# EasyEDA Pro project sonnette.epro, schematic Schematic1
Board Name: Board1; Create Date: 2026-03-04; Page Name: P1; Project Name: rk3506_doorbell; Schematic Name: Schematic1; Update Date: 2026-05-03; Company: Sonnette - Smart SIP Doorbell; Drawn: Pierre Jay; Page Size: A0; Version: V1.0
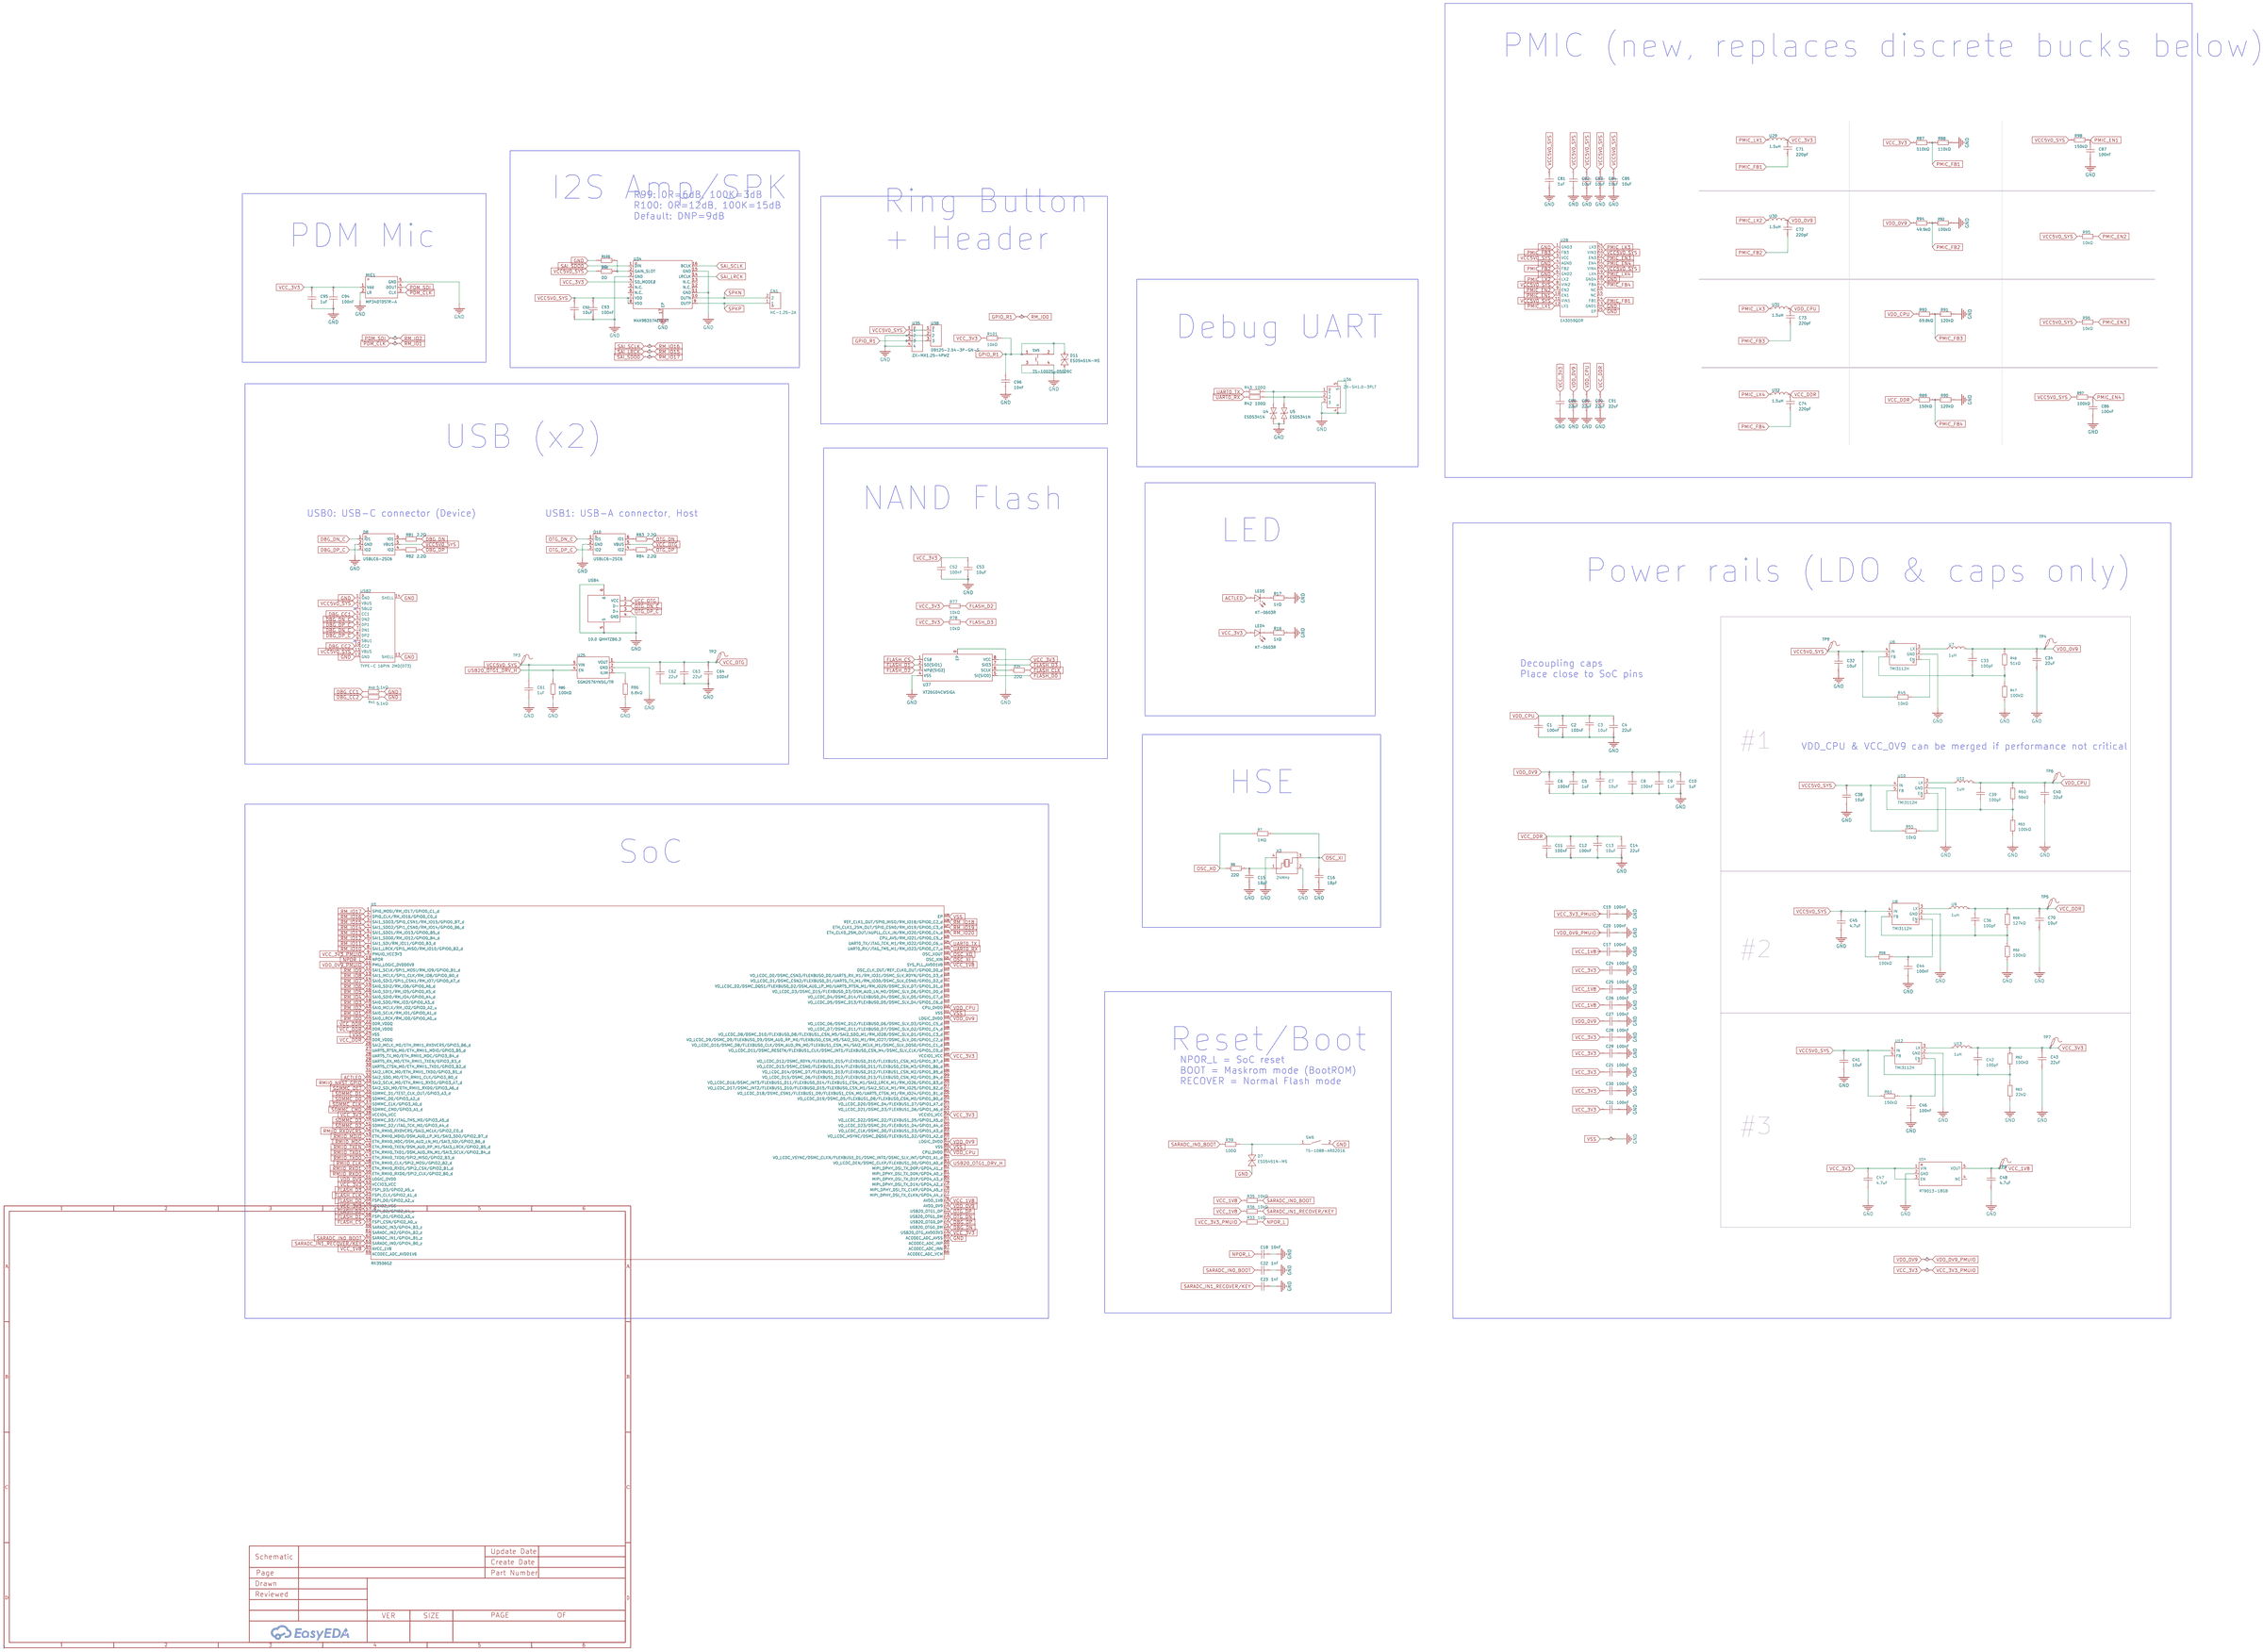
[diagram p0: schematic sheet]

## Parts
C1  100nF  [C0402]
C2  100nF  [C0402]
C3  10uF  [C0402]
C4  22uF  [C0603]
C5  1uF  [C0402]
C6  100nF  [C0402]
C7  10uF  [C0402]
C8  100nF  [C0402]
C9  1uF  [C0402]
C10  1uF  [C0402]
C11  100nF  [C0402]
C12  100nF  [C0402]
C13  10uF  [C0402]
C14  22uF  [C0603]
C15  18pF  [C0402]
C16  18pF  [C0402]
C17  100nF  [C0402]
C18  10nF  [C0402]
C19  100nF  [C0402]
C20  100nF  [C0402]
C21  100nF  [C0402]
C22  1nF  [C0402]
C23  1nF  [C0402]
C24  100nF  [C0402]
C25  100nF  [C0402]
C26  100nF  [C0402]
C27  100nF  [C0402]
C28  100nF  [C0402]
C29  100nF  [C0402]
C30  100nF  [C0402]
C31  100nF  [C0402]
C32  10uF  [C0603]  (no BOM)
C33  100pF  [C0402]  (no BOM)
C34  22uF  [C0603]  (no BOM)
C36  100pF  [C0402]  (no BOM)
C38  10uF  [C0603]  (no BOM)
C39  100pF  [C0402]  (no BOM)
C40  22uF  [C0603]  (no BOM)
C41  10uF  [C0603]  (no BOM)
C42  100pF  [C0402]  (no BOM)
C43  22uF  [C0603]  (no BOM)
C44  100nF  [C0402]  (no BOM)
C45  4.7uF  [C0603]  (no BOM)
C46  100nF  [C0402]  (no BOM)
C47  4.7uF  [C0603]
C48  4.7uF  [C0603]
C52  100nF  [C0402]
C53  10uF  [C0603]
C61  1uF  [C0402]
C62  22uF  [C0603]
C63  22uF  [C0603]
C64  100nF  [C0402]
C70  10uF  [C0603]  (no BOM)
C71  220pF  [C0402]
C72  220pF  [C0402]
C73  220pF  [C0402]
C74  220pF  [C0402]
C81  1uF  [C0402]
C82  10uF  [C0402]
C83  10uF  [C0402]
C84  10uF  [C0402]
C85  10uF  [C0402]
C86  100nF  [C0402]
C87  100nF  [C0402]
C88  22uF  [C0603]
C89  22uF  [C0603]
C90  22uF  [C0603]
C91  22uF  [C0603]
C92  10uF  [C0603]
C93  100nF  [C0402]
C94  100nF  [C0402]
C95  1uF  [C0402]
C96  10nF  [C0402]
CN1  HC-1.25-2A  [CONN-TH_2P-P1.25_HCTL_HC-1.25-2A]
D7  ESD5451N-MS  [DFN1006-2L_L1.0-W0.6-P0.60-BI]
D8  USBLC6-2SC6  [SOT-23-6_L2.9-W1.6-P0.95-LS2.8-BL]
D10  USBLC6-2SC6  [SOT-23-6_L2.9-W1.6-P0.95-LS2.8-BL]
D11  ESD5451N-MS  [DFN1006-2L_L1.0-W0.6-P0.60-BI]
LED4  KT-0603R  [LED0603-RD]
LED5  KT-0603R  [LED0603-RD]
MIC1  MP34DT05TR-A  [MIC-SMD_5P-L3.0-W4.0-P0.85-BL]
R6  22Ω  [R0402]
R7  1MΩ  [R0402]
R16  1kΩ  [R0402]
R17  1kΩ  [R0402]
R33  1kΩ  [R0402]
R34  22Ω  [R0402]
R35  10kΩ  [R0402]
R36  10kΩ  [R0402]
R39  100Ω  [R0402]
R40  5.1kΩ  [R0402]
R41  5.1kΩ  [R0402]
R42  100Ω  [R0402]
R43  100Ω  [R0402]
R45  10kΩ  [R0402]  (no BOM)
R46  51kΩ  [R0402]  (no BOM)
R47  100kΩ  [R0402]  (no BOM)
R50  100kΩ  [R0402]  (no BOM)
R51  10kΩ  [R0402]  (no BOM)
R53  100kΩ  [R0402]  (no BOM)
R58  100kΩ  [R0402]  (no BOM)
R59  127kΩ  [R0402]  (no BOM)
R60  56kΩ  [R0402]  (no BOM)
R61  150kΩ  [R0402]  (no BOM)
R62  100kΩ  [R0402]  (no BOM)
R63  22kΩ  [R0402]  (no BOM)
R77  10kΩ  [R0402]
R78  10kΩ  [R0402]
R81  2.2Ω  [R0402]
R82  2.2Ω  [R0402]
R83  2.2Ω  [R0402]
R84  2.2Ω  [R0402]
R85  100kΩ  [R0402]
R86  6.8kΩ  [R0402]
R87  510kΩ  [R0402]
R88  110kΩ  [R0402]
R89  150kΩ  [R0402]
R90  120kΩ  [R0402]
R91  120kΩ  [R0402]
R92  100kΩ  [R0402]
R93  69.8kΩ  [R0402]
R94  49.9kΩ  [R0402]
R95  10kΩ  [R0402]
R96  10kΩ  [R0402]
R97  100kΩ  [R0402]
R98  150kΩ  [R0402]
R99  0Ω  [R0402]  (no BOM)
R100  0Ω  [R0402]  (no BOM)
R101  10kΩ  [R0402]
SW5  TS-1002S-05026C  [KEY-SMD_4P-L6.0-W6.0-P4.50-LS9.0]
SW6  TS-1088-AR02016  [SW-SMD_L3.9-W3.0-P4.45]
TP2  -  [Test-Point-0.5mm]
TP3  -  [Test-Point-0.5mm]  (no BOM)
TP4  -  [Test-Point-0.5mm]
TP5  -  [Test-Point-0.5mm]
TP6  -  [Test-Point-0.5mm]
TP7  -  [Test-Point-0.5mm]
TP8  -  [Test-Point-0.5mm]
TP9  -  [Test-Point-0.5mm]
U1  RK3506G2  [QFN-128_L12.3-W12.3-P0.35-TL-EP9.1]
U4  ESD5341N  [DFN1006-2L-BI]
U5  ESD5341N  [DFN1006-2L-BI]
U6  TMI3112H  [SOT-23-5_L2.9-W1.6-P0.95-LS2.8-BR]  (no BOM)
U7  1uH  [IND-SMD_L2.5-W2.0-VLS252012CX-150M]  (no BOM)
U8  TMI3112H  [SOT-23-5_L2.9-W1.6-P0.95-LS2.8-BR]  (no BOM)
U9  1uH  [IND-SMD_L2.5-W2.0-VLS252012CX-150M]  (no BOM)
U10  TMI3112H  [SOT-23-5_L2.9-W1.6-P0.95-LS2.8-BR]  (no BOM)
U11  1uH  [IND-SMD_L2.5-W2.0-VLS252012CX-150M]  (no BOM)
U12  TMI3112H  [SOT-23-5_L2.9-W1.6-P0.95-LS2.8-BR]  (no BOM)
U13  1uH  [IND-SMD_L2.5-W2.0-VLS252012CX-150M]  (no BOM)
U14  RT9013-18GB  [SOT-23-5_L3.0-W1.7-P0.95-LS2.8-BR]
U25  SGM2576YN5G/TR  [SOT-23-5_L2.9-W1.6-P0.95-LS2.8-TL]
U28  EA3059QDR  [VQFN-24_L4.0-W4.0-P0.50-TL-EP2.5]
U29  1.5uH  [IND-SMD_L2.5-W2.0_MEKK2520TR47M]
U30  1.5uH  [IND-SMD_L2.5-W2.0_MEKK2520TR47M]
U31  1.5uH  [IND-SMD_L2.5-W2.0_MEKK2520TR47M]
U32  1.5uH  [IND-SMD_L2.5-W2.0_MEKK2520TR47M]
U34  MAX98357AETE+T  [TQFN-16_L3.0-W3.0-P0.50-BL-EP1.5]
U35  ZX-MX1.25-4PWZ  [CONN-TH_4P-P1.25_ZX-MX1.25-4PWZ]
U36  ZX-SH1.0-3PLT  [CONN-SMD_3P-P1.00_HDGC_HDGC1002WV-S-3P]
U37  XT26G04CWSIGA  [WSON-8_L8.0-W6.0-P1.27-TL-EP-1]
U38  DB125-2.54-3P-GN-S  [CONN-TH_DB125-2.54-3P-GN]
USB2  TYPE-C 16PIN 2MD(073)  [USB-C-SMD_TYPE-C-6PIN-2MD-073]
USB4  10.0 QHHTZB6.3  [USB-A-TH_10.0QHHTZB6.3]
X3  24MHz  [CRYSTAL-SMD_4P-L3.2-W2.5-BL_SIT8008BI]

## Library data of the parts
C1 C2 C6 C8 C11 C12 C17 C19-C21 C24-C31 C44 C46 C52 C64 C86 C87 C93 C94 = CL05B104KO5NNNC: Capacitance:100nF Tolerance:±10% Tolerance:±10% Voltage Rating:16V Temperature Coefficient:X7R; LCSC Part Name: 100nF ±10% 16V; Supplier Part: C1525; Manufacturer: SAMSUNG(三星); Supplier Footprint: 0402; JLCPCB Part Class: Basic Part; Datasheet: https://item.szlcsc.com/datasheet/CL05B104KO5NNNC/1877.html; Supplier: LCSC; Tolerance: ±10%; Voltage Rating: 16V; Temperature Coefficient: X7R
C3 C7 C13 = CL05A106MQ5NUNC: Capacitance:10uF Tolerance:±20% Tolerance:±20% Voltage Rating:6.3V Temperature Coefficient:X5R; LCSC Part Name: 10uF ±20% 6.3V; Supplier Part: C15525; Manufacturer: SAMSUNG(三星); Supplier Footprint: 0402; JLCPCB Part Class: Basic Part; Datasheet: https://item.szlcsc.com/datasheet/CL05A106MQ5NUNC/16204.html; Supplier: LCSC; Tolerance: ±20%; Voltage Rating: 6.3V; Temperature Coefficient: X5R
C4 C14 C34 C40 C43 C62 C63 C88-C91 = CL10A226MQ8NRNC: Capacitance:22uF Tolerance:±20% Tolerance:±20% Voltage Rating:6.3V Temperature Coefficient:X5R; LCSC Part Name: 22uF ±20% 6.3V; Supplier Part: C59461; Manufacturer: SAMSUNG(三星); Supplier Footprint: 0603; JLCPCB Part Class: Basic Part; Datasheet: https://item.szlcsc.com/datasheet/CL10A226MQ8NRNC/60514.html; Supplier: LCSC; Tolerance: ±20%; Voltage Rating: 6.3V; Temperature Coefficient: X5R
C5 C9 C10 C61 C81 C95 = CL05A105KA5NQNC: Capacitance:1uF Tolerance:±10% Tolerance:±10% Voltage Rating:25V Temperature Coefficient:X5R; LCSC Part Name: 1uF ±10% 25V; Supplier Part: C52923; Manufacturer: SAMSUNG(三星); Supplier Footprint: 0402; JLCPCB Part Class: Basic Part; Datasheet: https://item.szlcsc.com/datasheet/CL05A105KA5NQNC/53938.html; Supplier: LCSC; Tolerance: ±10%; Voltage Rating: 25V; Temperature Coefficient: X5R
C15 C16 = 0402CG180J500NT: Capacitance:18pF Tolerance:±5% Tolerance:±5% Voltage Rating:50V Temperature Coefficient:C0G; LCSC Part Name: 18pF ±5% 50V; Supplier Part: C1549; Manufacturer: FH(风华); Supplier Footprint: 0402; JLCPCB Part Class: Basic Part; Datasheet: https://item.szlcsc.com/datasheet/0402CG180J500NT/1901.html; Supplier: LCSC; Tolerance: ±5%; Voltage Rating: 50V; Temperature Coefficient: C0G
C18 C96 = CL05B103KB5NNNC: Capacitance:10nF Tolerance:±10% Tolerance:±10% Voltage Rating:50V Temperature Coefficient:X7R; LCSC Part Name: 10nF ±10% 50V; Supplier Part: C15195; Manufacturer: SAMSUNG(三星); Supplier Footprint: 0402; JLCPCB Part Class: Basic Part; Datasheet: https://item.szlcsc.com/datasheet/CL05B103KB5NNNC/15869.html; Supplier: LCSC; Tolerance: ±10%; Voltage Rating: 50V; Temperature Coefficient: X7R
C22 C23 = 0402B102K500NT: Capacitance:1nF Tolerance:±10% Tolerance:±10% Voltage Rating:50V Temperature Coefficient:X7R; LCSC Part Name: 1nF ±10% 50V; Supplier Part: C1523; Manufacturer: FH(风华); Supplier Footprint: 0402; JLCPCB Part Class: Basic Part; Datasheet: https://item.szlcsc.com/datasheet/0402B102K500NT/1875.html; Supplier: LCSC; Tolerance: ±10%; Voltage Rating: 50V; Temperature Coefficient: X7R
C32 C38 C41 C53 C70 = CL10A106KP8NNNC: Capacitance:10uF Tolerance:±10% Tolerance:±10% Voltage Rating:10V Temperature Coefficient:X5R; LCSC Part Name: 10uF ±10% 10V; Supplier Part: C19702; Manufacturer: SAMSUNG(三星); Supplier Footprint: 0603; JLCPCB Part Class: Basic Part; Datasheet: https://item.szlcsc.com/datasheet/CL10A106KP8NNNC/20411.html; Supplier: LCSC; Tolerance: ±10%; Voltage Rating: 10V; Temperature Coefficient: X5R
C33 C36 C39 C42 = 0402CG101J500NT: Capacitance:100pF Tolerance:±5% Tolerance:±5% Voltage Rating:50V Temperature Coefficient:C0G; LCSC Part Name: 100pF ±5% 50V; Supplier Part: C1546; Manufacturer: FH(风华); Supplier Footprint: 0402; JLCPCB Part Class: Basic Part; Datasheet: https://item.szlcsc.com/datasheet/0402CG101J500NT/1898.html; Supplier: LCSC; Tolerance: ±5%; Voltage Rating: 50V; Temperature Coefficient: C0G
C45 C47 C48 = CL10A475KO8NNNC: Capacitance:4.7uF Tolerance:±10% Tolerance:±10% Voltage Rating:16V Temperature Coefficient:X5R; LCSC Part Name: 4.7uF ±10% 16V; Supplier Part: C19666; Manufacturer: SAMSUNG(三星); Supplier Footprint: 0603; JLCPCB Part Class: Basic Part; Datasheet: https://item.szlcsc.com/datasheet/CL10A475KO8NNNC/20375.html; Supplier: LCSC; Tolerance: ±10%; Voltage Rating: 16V; Temperature Coefficient: X5R
C71-C74 = 0402B221K500NT: Capacitance:220pF Tolerance:±10% Tolerance:±10% Voltage Rating:50V Temperature Coefficient:X7R; LCSC Part Name: 220pF ±10% 50V; Supplier Part: C1530; Manufacturer: FH(风华); Supplier Footprint: 0402; JLCPCB Part Class: Basic Part; Datasheet: https://item.szlcsc.com/datasheet/0402B221K500NT/1882.html; Supplier: LCSC; Tolerance: ±10%; Voltage Rating: 50V; Temperature Coefficient: X7R
C82-C85 = CL05A106MP5NUNC_C315248: Capacitance:10uF Tolerance:±20% Tolerance:±20% Voltage Rating:10V Temperature Coefficient:X5R; LCSC Part Name: 10uF ±20% 10V; Supplier Part: C315248; Manufacturer: SAMSUNG(三星); Manufacturer Part: CL05A106MP5NUNC; Supplier Footprint: 0402; JLCPCB Part Class: Extended Part; Datasheet: https://item.szlcsc.com/datasheet/CL05A106MP5NUNC/297154.html; Supplier: LCSC; Tolerance: ±20%; Voltage Rating: 10V; Temperature Coefficient: X5R
C92 = CL10A106MA8NRNC: Capacitance:10uF Tolerance:±20% Tolerance:±20% Voltage Rating:25V Temperature Coefficient:X5R; LCSC Part Name: 10uF ±20% 25V; Supplier Part: C96446; Manufacturer: SAMSUNG(三星); Supplier Footprint: 0603; JLCPCB Part Class: Basic Part; Datasheet: https://item.szlcsc.com/datasheet/CL10A106MA8NRNC/97651.html; Supplier: LCSC; Tolerance: ±20%; Voltage Rating: 25V; Temperature Coefficient: X5R
CN1 = HC-1.25-2A: Pins Structure:1x2P Pitch:1.25mm Mounting Type:Through Hole Reference Series:PicoBlade(MX 1.25) Number of Pins:2P Number of Rows:1 Number of PINs Per Row:2 Row Spacing:- Current Rating:1A Contact Material:Brass Contact Plating:Tin Operating Temperature:-2; LCSC Part Name: 1x2P 间距:1.25mm 直插 系列:PicoBlade(MX 1.25); Supplier Part: C2845520; Manufacturer: HCTL(华灿天禄); Supplier Footprint: 插件,P=1.25mm; JLCPCB Part Class: Extended Part; Datasheet: https://item.szlcsc.com/datasheet/HC-1.25-2A/3039201.html; Supplier: LCSC; Pins Structure: 1x2P; Pitch: 1.25mm; Mounting Type: Through Hole; Reference Series: PicoBlade(MX 1.25); Number of Pins: 2P; Number of Rows: 1; Number of PINs Per Row: 2; Current Rating: 1A; Contact Material: Brass; Contact Plating: Tin; Operating Temperature: -25℃~+85℃; Voltage Rating: 125V; Plastic Material: PA46; Flame Retardant Rating: UL94V-0; Z-Height of the Board: 4.7mm; X-Length of Bottom Edge on Board (Spacing Line): 4.25mm; Y-Width of Bottom Edge on Board: 3.2mm
D7 D11 = ESD5451N-MS: Polarity:Bidirectional Reverse Stand-Off Voltage (Vrwm):5V Clamping Voltage:10V Peak Pulse Current (Ipp):5A Peak Pulse Power Dissipation (Ppp):80W Voltage - Breakdown:8.4V Reverse Leakage Current (Ir):1uA Number of Channels:1.0 Operating Temperature:- Ope; LCSC Part Name: PB 双向ESD 5V截止 峰值浪涌电流：5A; Supplier Part: C2802295; Manufacturer: MSKSEMI(美森科); Supplier Footprint: DFN1006-2; JLCPCB Part Class: Extended Part; Datasheet: https://item.szlcsc.com/datasheet/ESD5451N-MS/2942713.html; Supplier: LCSC; Polarity: Bidirectional; Reverse Stand-Off Voltage (Vrwm): 5V; Clamping Voltage: 10V; Peak Pulse Current (Ipp): 5A; Peak Pulse Power Dissipation (Ppp): 80W; Voltage - Breakdown: 8.4V; Reverse Leakage Current (Ir): 1uA; Number of Channels: 1.0; level of protection: IEC 61000-4-2；IEC 61000-4-4; Type: ESD; Junction Capacitance: 15pF
D8 D10 = USBLC6-2SC6_C2827654: Polarity:Unidirectional Reverse Stand-Off Voltage (Vrwm):5V Clamping Voltage:12V Peak Pulse Current (Ipp):6A Peak Pulse Power Dissipation (Ppp):150W Voltage - Breakdown:6V Reverse Leakage Current (Ir):80nA Number of Channels:2 Operating Temperature:-55℃~+; LCSC Part Name: ESD，可防30kV静电; Supplier Part: C2827654; Manufacturer: TECH PUBLIC(台舟); Supplier Footprint: SOT-23-6; JLCPCB Part Class: Extended Part; Datasheet: https://item.szlcsc.com/datasheet/USBLC6-2SC6/2973336.html; Supplier: LCSC; Polarity: Unidirectional; Reverse Stand-Off Voltage (Vrwm): 5V; Clamping Voltage: 12V; Peak Pulse Current (Ipp): 6A; Peak Pulse Power Dissipation (Ppp): 150W; Voltage - Breakdown: 6V; Reverse Leakage Current (Ir): 80nA; Number of Channels: 2; Operating Temperature: -55℃~+125℃; level of protection: IEC 61000-4-2；IEC 61000-4-4；IEC 61000-4-5; Type: ESD; Junction Capacitance: 0.35pF
LED4 LED5 = KT-0603R: Emitted Color:Red Power Dissipation:- Forward Current:- Dominant Wavelength:- Dominant Wavelength:- Peak Wavelength:- Diode Configuration:- Lens Color:- Color Temperature:- Color Temperature:- Viewing Angle:- Mounting Sytle:- Operating Temperature:-40℃~+8; LCSC Part Name: 0603 红灯 高亮; Supplier Part: C2286; Manufacturer: KENTO; Supplier Footprint: 0603; JLCPCB Part Class: Basic Part; Datasheet: https://atta.szlcsc.com/upload/public/pdf/source/20160616/1466072038404.pdf; Supplier: LCSC; Emitted Color: Red; Operating Temperature: -40℃~+85℃
MIC1 = MP34DT05TR-A: Direction:全指向 Supply Voltage:1.8V Supply Voltage:1.8V Current Consumption:650uA Current Consumption:650uA SNR(Signal to Noise Ratio):64dB Sensitivity:-26dB Sensitivity:-26dB Impedance:-; Supplier Part: C2688664; Manufacturer: ST(意法半导体); Supplier Footprint: HCLGA-4LD(3x4); JLCPCB Part Class: Extended Part; Datasheet: https://atta.szlcsc.com/upload/public/pdf/source/20210205/C2688664_535B04288C825B3B153C08EB8B884814.pdf; Supplier: LCSC; Direction: 全指向; Supply Voltage: 1.8V; Current Consumption: 650uA; SNR(Signal to Noise Ratio): 64dB; Sensitivity: -26dB
R6 R34 = 0402WGF220JTCE: Type:Thick Film Resistors Resistance:22Ω Tolerance:±1% Tolerance:±1% Power(Watts): Overload Voltage (Max): Temperature Coefficient:±100ppm/℃ Temperature Coefficient:±100ppm/℃ Operating Temperature Range:-55℃~+155℃ Operating Temperature Range:-55℃~+155℃; LCSC Part Name: 22Ω ±1% 62.5mW 厚膜电阻; Supplier Part: C25092; Manufacturer: UNI-ROYAL(厚声); Supplier Footprint: 0402; JLCPCB Part Class: Basic Part; Datasheet: https://atta.szlcsc.com/upload/public/pdf/source/20200306/C422600_1E6D84923E4A46A82E41ADD87F860B5C.pdf; Supplier: LCSC; Type: Thick Film Resistors; Tolerance: ±1%; Temperature Coefficient: ±100ppm/℃; Operating Temperature Range: -55℃~+155℃
R7 = 0402WGF1004TCE: Type:Thick Film Resistor Resistance:1MΩ Tolerance:±1% Tolerance:±1% Power(Watts):62.5mW Voltage-Supply(Max):50V Temperature Coefficient:±100ppm/℃ Temperature Coefficient:±100ppm/℃ Operating Temperature:-55℃~+155℃ Operating Temperature:-55℃~+155℃; LCSC Part Name: 1MΩ ±1% 62.5mW 厚膜电阻; Supplier Part: C26083; Manufacturer: UNI-ROYAL(厚声); Supplier Footprint: 0402; JLCPCB Part Class: Basic Part; Datasheet: https://item.szlcsc.com/datasheet/0402WGF1004TCE/26826.html; Supplier: LCSC; Type: Thick Film Resistor; Tolerance: ±1%; Power(Watts): 62.5mW; Voltage-Supply(Max): 50V; Temperature Coefficient: ±100ppm/℃; Operating Temperature: -55℃~+155℃
R16 R17 R33 = 0402WGF1001TCE: Type:Thick Film Resistor Resistance:1kΩ Tolerance:±1% Tolerance:±1% Power(Watts):62.5mW Voltage-Supply(Max):50V Temperature Coefficient:±100ppm/℃ Temperature Coefficient:±100ppm/℃ Operating Temperature:-55℃~+155℃ Operating Temperature:-55℃~+155℃; LCSC Part Name: 1kΩ ±1% 62.5mW 厚膜电阻; Supplier Part: C11702; Manufacturer: UNI-ROYAL(厚声); Supplier Footprint: 0402; JLCPCB Part Class: Basic Part; Datasheet: https://item.szlcsc.com/datasheet/0402WGF1001TCE/12256.html; Supplier: LCSC; Type: Thick Film Resistor; Tolerance: ±1%; Power(Watts): 62.5mW; Voltage-Supply(Max): 50V; Temperature Coefficient: ±100ppm/℃; Operating Temperature: -55℃~+155℃
R35 R36 R45 R51 R77 R78 R95 R96 R101 = 0402WGF1002TCE: Type:Thick Film Resistor Resistance:10kΩ Tolerance:±1% Tolerance:±1% Power(Watts):62.5mW Voltage-Supply(Max):50V Temperature Coefficient:±100ppm/℃ Temperature Coefficient:±100ppm/℃ Operating Temperature:-55℃~+155℃ Operating Temperature:-55℃~+155℃; LCSC Part Name: 10kΩ ±1% 62.5mW 厚膜电阻; Supplier Part: C25744; Manufacturer: UNI-ROYAL(厚声); Supplier Footprint: 0402; JLCPCB Part Class: Basic Part; Datasheet: https://item.szlcsc.com/datasheet/0402WGF1002TCE/26487.html; Supplier: LCSC; Type: Thick Film Resistor; Tolerance: ±1%; Power(Watts): 62.5mW; Voltage-Supply(Max): 50V; Temperature Coefficient: ±100ppm/℃; Operating Temperature: -55℃~+155℃
R39 R42 R43 = 0402WGF1000TCE: Type:Thick Film Resistors Resistance: Tolerance:±1% Tolerance:±1% Power(Watts): Overload Voltage (Max): Temperature Coefficient:±200ppm/℃ Temperature Coefficient:±200ppm/℃ Operating Temperature Range:-55℃~+155℃ Operating Temperature Range:-55℃~+155℃; LCSC Part Name: 100Ω ±1% 62.5mW 厚膜电阻; Supplier Part: C25076; Manufacturer: UNI-ROYAL(厚声); Supplier Footprint: 0402; JLCPCB Part Class: Basic Part; Datasheet: https://atta.szlcsc.com/upload/public/pdf/source/20200306/C422600_1E6D84923E4A46A82E41ADD87F860B5C.pdf; Supplier: LCSC; Type: Thick Film Resistors; Tolerance: ±1%; Temperature Coefficient: ±200ppm/℃; Operating Temperature Range: -55℃~+155℃
R40 R41 = 0402WGF5101TCE: Type:Thick Film Resistor Resistance:5.1kΩ Tolerance:±1% Tolerance:±1% Power(Watts):62.5mW Voltage-Supply(Max):50V Temperature Coefficient:±100ppm/℃ Temperature Coefficient:±100ppm/℃ Operating Temperature:-55℃~+155℃ Operating Temperature:-55℃~+155℃; LCSC Part Name: 5.1kΩ ±1% 62.5mW 厚膜电阻; Supplier Part: C25905; Manufacturer: UNI-ROYAL(厚声); Supplier Footprint: 0402; JLCPCB Part Class: Basic Part; Datasheet: https://item.szlcsc.com/datasheet/0402WGF5101TCE/26648.html; Supplier: LCSC; Type: Thick Film Resistor; Tolerance: ±1%; Power(Watts): 62.5mW; Voltage-Supply(Max): 50V; Temperature Coefficient: ±100ppm/℃; Operating Temperature: -55℃~+155℃
R46 = 0402WGF5102TCE: Type:Thick Film Resistors Resistance:51kΩ Tolerance:±1% Tolerance:±1% Power(Watts): Overload Voltage (Max): Temperature Coefficient:±100ppm/℃ Temperature Coefficient:±100ppm/℃ Operating Temperature Range:-55℃~+155℃ Operating Temperature Range:-55℃~+155℃; LCSC Part Name: 51kΩ ±1% 62.5mW 厚膜电阻; Supplier Part: C25794; Manufacturer: UNI-ROYAL(厚声); Supplier Footprint: 0402; JLCPCB Part Class: Basic Part; Datasheet: https://atta.szlcsc.com/upload/public/pdf/source/20200306/C422600_1E6D84923E4A46A82E41ADD87F860B5C.pdf; Supplier: LCSC; Type: Thick Film Resistors; Tolerance: ±1%; Temperature Coefficient: ±100ppm/℃; Operating Temperature Range: -55℃~+155℃
R47 R50 R53 R58 R62 R85 R92 R97 = 0402WGF1003TCE: Type:Thick Film Resistor Resistance:100kΩ Tolerance:±1% Tolerance:±1% Power(Watts):62.5mW Voltage-Supply(Max):50V Temperature Coefficient:±100ppm/℃ Temperature Coefficient:±100ppm/℃ Operating Temperature:-55℃~+155℃ Operating Temperature:-55℃~+155℃; LCSC Part Name: 100kΩ ±1% 62.5mW 厚膜电阻; Supplier Part: C25741; Manufacturer: UNI-ROYAL(厚声); Supplier Footprint: 0402; JLCPCB Part Class: Basic Part; Datasheet: https://item.szlcsc.com/datasheet/0402WGF1003TCE/26484.html; Supplier: LCSC; Type: Thick Film Resistor; Tolerance: ±1%; Power(Watts): 62.5mW; Voltage-Supply(Max): 50V; Temperature Coefficient: ±100ppm/℃; Operating Temperature: -55℃~+155℃
R59 = 0402WGF1273TCE: Type:Thick Film Resistor Resistance:127kΩ Tolerance:±1% Tolerance:±1% Power(Watts):62.5mW Voltage-Supply(Max):50V Temperature Coefficient:±100ppm/℃ Temperature Coefficient:±100ppm/℃ Operating Temperature:-55℃~+155℃ Operating Temperature:-55℃~+155℃; LCSC Part Name: 127kΩ ±1% 62.5mW 厚膜电阻; Supplier Part: C25751; Manufacturer: UNI-ROYAL(厚声); Supplier Footprint: 0402; JLCPCB Part Class: Extended Part; Datasheet: https://item.szlcsc.com/datasheet/0402WGF1273TCE/26494.html; Supplier: LCSC; Type: Thick Film Resistor; Tolerance: ±1%; Power(Watts): 62.5mW; Voltage-Supply(Max): 50V; Temperature Coefficient: ±100ppm/℃; Operating Temperature: -55℃~+155℃
R60 = 0402WGF5602TCE: Type:Thick Film Resistor Resistance:56kΩ Tolerance:±1% Tolerance:±1% Power(Watts):62.5mW Voltage-Supply(Max):50V Temperature Coefficient:±100ppm/℃ Temperature Coefficient:±100ppm/℃ Operating Temperature:-55℃~+155℃ Operating Temperature:-55℃~+155℃; LCSC Part Name: 56kΩ ±1% 62.5mW 厚膜电阻; Supplier Part: C25796; Manufacturer: UNI-ROYAL(厚声); Supplier Footprint: 0402; JLCPCB Part Class: Extended Part; Datasheet: https://item.szlcsc.com/datasheet/0402WGF5602TCE/26539.html; Supplier: LCSC; Type: Thick Film Resistor; Tolerance: ±1%; Power(Watts): 62.5mW; Voltage-Supply(Max): 50V; Temperature Coefficient: ±100ppm/℃; Operating Temperature: -55℃~+155℃
R61 R89 R98 = 0402WGF1503TCE: Type:Thick Film Resistors Resistance:150kΩ Tolerance:±1% Tolerance:±1% Power(Watts): Overload Voltage (Max): Temperature Coefficient:±100ppm/℃ Temperature Coefficient:±100ppm/℃ Operating Temperature Range:-55℃~+155℃ Operating Temperature Range:-55℃~+155℃; LCSC Part Name: 150kΩ ±1% 62.5mW 厚膜电阻; Supplier Part: C25755; Manufacturer: UNI-ROYAL(厚声); Supplier Footprint: 0402; JLCPCB Part Class: Extended Part; Datasheet: https://atta.szlcsc.com/upload/public/pdf/source/20200306/C422600_1E6D84923E4A46A82E41ADD87F860B5C.pdf; Supplier: LCSC; Type: Thick Film Resistors; Tolerance: ±1%; Temperature Coefficient: ±100ppm/℃; Operating Temperature Range: -55℃~+155℃
R63 = 0402WGF2202TCE: Type:Thick Film Resistor Resistance:22kΩ Tolerance:±1% Tolerance:±1% Power(Watts):62.5mW Voltage-Supply(Max):50V Temperature Coefficient:±100ppm/℃ Temperature Coefficient:±100ppm/℃ Operating Temperature:-55℃~+155℃ Operating Temperature:-55℃~+155℃; LCSC Part Name: 22kΩ ±1% 62.5mW 厚膜电阻; Supplier Part: C25768; Manufacturer: UNI-ROYAL(厚声); Supplier Footprint: 0402; JLCPCB Part Class: Basic Part; Datasheet: https://item.szlcsc.com/datasheet/0402WGF2202TCE/26511.html; Supplier: LCSC; Type: Thick Film Resistor; Tolerance: ±1%; Power(Watts): 62.5mW; Voltage-Supply(Max): 50V; Temperature Coefficient: ±100ppm/℃; Operating Temperature: -55℃~+155℃
R81-R84 = 0402WGF220KTCE: Type:Thick Film Resistors Resistance:2.2Ω Tolerance:±1% Tolerance:±1% Power(Watts): Overload Voltage (Max): Temperature Coefficient:±200ppm/℃ Temperature Coefficient:±200ppm/℃ Operating Temperature Range:-55℃~+155℃ Operating Temperature Range:-55℃~+155℃; LCSC Part Name: 2.2Ω ±1% 62.5mW 厚膜电阻; Supplier Part: C25101; Manufacturer: UNI-ROYAL(厚声); Supplier Footprint: 0402; JLCPCB Part Class: Extended Part; Datasheet: https://atta.szlcsc.com/upload/public/pdf/source/20200306/C422600_1E6D84923E4A46A82E41ADD87F860B5C.pdf; Supplier: LCSC; Type: Thick Film Resistors; Tolerance: ±1%; Temperature Coefficient: ±200ppm/℃; Operating Temperature Range: -55℃~+155℃
R86 = 0402WGF6801TCE: Type:Thick Film Resistor Resistance:6.8kΩ Tolerance:±1% Tolerance:±1% Power(Watts):62.5mW Voltage-Supply(Max):50V Temperature Coefficient:±100ppm/℃ Temperature Coefficient:±100ppm/℃ Operating Temperature:-55℃~+155℃ Operating Temperature:-55℃~+155℃; LCSC Part Name: 6.8kΩ ±1% 62.5mW 厚膜电阻; Supplier Part: C25917; Manufacturer: UNI-ROYAL(厚声); Supplier Footprint: 0402; JLCPCB Part Class: Extended Part; Datasheet: https://item.szlcsc.com/datasheet/0402WGF6801TCE/26660.html; Supplier: LCSC; Type: Thick Film Resistor; Tolerance: ±1%; Power(Watts): 62.5mW; Voltage-Supply(Max): 50V; Temperature Coefficient: ±100ppm/℃; Operating Temperature: -55℃~+155℃
R87 = 0402WGF5103TCE: Type:Thick Film Resistor Resistance:510kΩ Tolerance:±1% Tolerance:±1% Power(Watts):62.5mW Voltage-Supply(Max):50V Temperature Coefficient:±100ppm/℃ Temperature Coefficient:±100ppm/℃ Operating Temperature:-55℃~+155℃ Operating Temperature:-55℃~+155℃; LCSC Part Name: 510kΩ ±1% 62.5mW 厚膜电阻; Supplier Part: C11616; Manufacturer: UNI-ROYAL(厚声); Supplier Footprint: 0402; JLCPCB Part Class: Extended Part; Datasheet: https://item.szlcsc.com/datasheet/0402WGF5103TCE/12170.html; Supplier: LCSC; Type: Thick Film Resistor; Tolerance: ±1%; Power(Watts): 62.5mW; Voltage-Supply(Max): 50V; Temperature Coefficient: ±100ppm/℃; Operating Temperature: -55℃~+155℃
R88 = 0402WGF1103TCE: Type:Thick Film Resistor Resistance:110kΩ Tolerance:±1% Tolerance:±1% Power(Watts):62.5mW Voltage-Supply(Max):50V Temperature Coefficient:±100ppm/℃ Temperature Coefficient:±100ppm/℃ Operating Temperature:-55℃~+155℃ Operating Temperature:-55℃~+155℃; LCSC Part Name: 110kΩ ±1% 62.5mW 厚膜电阻; Supplier Part: C25745; Manufacturer: UNI-ROYAL(厚声); Supplier Footprint: 0402; JLCPCB Part Class: Extended Part; Datasheet: https://item.szlcsc.com/datasheet/0402WGF1103TCE/26488.html; Supplier: LCSC; Type: Thick Film Resistor; Tolerance: ±1%; Power(Watts): 62.5mW; Voltage-Supply(Max): 50V; Temperature Coefficient: ±100ppm/℃; Operating Temperature: -55℃~+155℃
R90 R91 = 0402WGF1203TCE: Type:Thick Film Resistor Resistance:120kΩ Tolerance:±1% Tolerance:±1% Power(Watts):62.5mW Voltage-Supply(Max):50V Temperature Coefficient:±100ppm/℃ Temperature Coefficient:±100ppm/℃ Operating Temperature:-55℃~+155℃ Operating Temperature:-55℃~+155℃; LCSC Part Name: 120kΩ ±1% 62.5mW 厚膜电阻; Supplier Part: C25750; Manufacturer: UNI-ROYAL(厚声); Supplier Footprint: 0402; JLCPCB Part Class: Extended Part; Datasheet: https://item.szlcsc.com/datasheet/0402WGF1203TCE/26493.html; Supplier: LCSC; Type: Thick Film Resistor; Tolerance: ±1%; Power(Watts): 62.5mW; Voltage-Supply(Max): 50V; Temperature Coefficient: ±100ppm/℃; Operating Temperature: -55℃~+155℃
R93 = 0402WGF6982TCE: Type:Thick Film Resistor Resistance:69.8kΩ Tolerance:±1% Tolerance:±1% Power(Watts):62.5mW Voltage-Supply(Max):50V Temperature Coefficient:±100ppm/℃ Temperature Coefficient:±100ppm/℃ Operating Temperature:-55℃~+155℃ Operating Temperature:-55℃~+155℃; LCSC Part Name: 69.8kΩ ±1% 62.5mW 厚膜电阻; Supplier Part: C26985; Manufacturer: UNI-ROYAL(厚声); Supplier Footprint: 0402; JLCPCB Part Class: Extended Part; Datasheet: https://item.szlcsc.com/datasheet/0402WGF6982TCE/27734.html; Supplier: LCSC; Type: Thick Film Resistor; Tolerance: ±1%; Power(Watts): 62.5mW; Voltage-Supply(Max): 50V; Temperature Coefficient: ±100ppm/℃; Operating Temperature: -55℃~+155℃
R94 = 0402WGF4992TCE: Type:Thick Film Resistor Resistance:49.9kΩ Tolerance:±1% Tolerance:±1% Power(Watts):62.5mW Voltage-Supply(Max):50V Temperature Coefficient:±100ppm/℃ Temperature Coefficient:±100ppm/℃ Operating Temperature:-55℃~+155℃ Operating Temperature:-55℃~+155℃; LCSC Part Name: 49.9kΩ ±1% 62.5mW 厚膜电阻; Supplier Part: C25897; Manufacturer: UNI-ROYAL(厚声); Supplier Footprint: 0402; JLCPCB Part Class: Extended Part; Datasheet: https://item.szlcsc.com/datasheet/0402WGF4992TCE/26640.html; Supplier: LCSC; Type: Thick Film Resistor; Tolerance: ±1%; Power(Watts): 62.5mW; Voltage-Supply(Max): 50V; Temperature Coefficient: ±100ppm/℃; Operating Temperature: -55℃~+155℃
R99 R100 = 0402WGF0000TCE: Type:Thick Film Resistor Resistance:0Ω Tolerance:±1% Tolerance:±1% Power(Watts):62.5mW Voltage-Supply(Max):50V Temperature Coefficient:±800ppm/℃ Temperature Coefficient:±800ppm/℃ Operating Temperature:-55℃~+155℃ Operating Temperature:-55℃~+155℃; LCSC Part Name: 0Ω ±1% 62.5mW 厚膜电阻; Supplier Part: C17168; Manufacturer: UNI-ROYAL(厚声); Supplier Footprint: 0402; JLCPCB Part Class: Basic Part; Datasheet: https://item.szlcsc.com/datasheet/0402WGF0000TCE/17853.html; Supplier: LCSC; Type: Thick Film Resistor; Tolerance: ±1%; Power(Watts): 62.5mW; Voltage-Supply(Max): 50V; Temperature Coefficient: ±800ppm/℃; Operating Temperature: -55℃~+155℃
SW5 = TS-1002S-05026C: Circuit:SPST Actuator Style:Round Button Mounting Type:Surface Mount,Vertical Length:6mm Width:6mm Switch Height:5mm Contact Current:50mA Voltage Rating:12V With Lamp:- Life:-; LCSC Part Name: 6*6*5mm 立贴 轻触开关; Supplier Part: C455110; Manufacturer: XUNPU(讯普); Supplier Footprint: SMD-4P,6x6mm; JLCPCB Part Class: Extended Part; Datasheet: https://item.szlcsc.com/datasheet/TS-1002S-05026C/457515.html; Supplier: LCSC; Circuit: SPST; Actuator Style: Round Button; Mounting Type: Surface Mount,Vertical; Length: 6mm; Width: 6mm; Switch Height: 5mm; Contact Current: 50mA; Voltage Rating: 12V
SW6 = TS-1088-AR02016: Circuit:SPST Actuator Style:Round Button Operating Force:1.6N Mounting Type:Surface Mount,Vertical Length:4mm Width:3mm Switch Height:2mm with Bracket:Without Bracket Contact Current:50mA Voltage Rating:12V Actuator/Cap Color:Black Termination Style:SMD(S; LCSC Part Name: 4*3*2mm 立贴 轻触开关; Supplier Part: C720477; Manufacturer: XUNPU(讯普); Supplier Footprint: SMD,4x3mm; JLCPCB Part Class: Basic Part; Datasheet: https://item.szlcsc.com/datasheet/TS-1088-AR02016/763484.html; Supplier: LCSC; Circuit: SPST; Actuator Style: Round Button; Operating Force: 1.6N; Mounting Type: Surface Mount,Vertical; Length: 4mm; Width: 3mm; Switch Height: 2mm; with Bracket: Without Bracket; Contact Current: 50mA; Voltage Rating: 12V; Actuator/Cap Color: Black; Termination Style: SMD(SMT) Tab; Life: 100,000 Cycles; Operating Temperature: -30℃~+80℃
TP2-TP9 = Test-Point: Test Point 测试点
U1 = RK3506G2: Supplier Part: C42416745; Manufacturer: Rockchip(瑞芯微); Supplier Footprint: QFN-128(12.3x12.3); JLCPCB Part Class: Extended Part; Datasheet: https://item.szlcsc.com/datasheet/RK3506G2/44418153.html; Supplier: LCSC
U4 U5 = ESD5341N_C20612964: LCSC Part Name: ESD静电保护管; Supplier Part: C20612964; Manufacturer: KUU; Supplier Footprint: DFN1006-2L; JLCPCB Part Class: Extended Part; Datasheet: https://atta.szlcsc.com/upload/public/pdf/source/20240126/9EE8C033ACD76A81C21292FAA1DFE4C1.pdf; Supplier: LCSC
U6 U8 U10 U12 = TMI3112H: Function:Buck Voltage - Supply:2.7V~5.5V Voltage - Supply:2.7V~5.5V Output Voltage:600mV~5.5V Output Voltage:600mV~5.5V Output Current:2A Frequency - Switching:2.3MHz Frequency - Switching:2.3MHz Operating Temperature:-40℃~+125℃@(TJ) Operating Temperature; LCSC Part Name: 2.3MHz 2A 同步降压转换器; Supplier Part: C2985060; Manufacturer: TMI(拓尔微); Supplier Footprint: SOT-23-5; JLCPCB Part Class: Extended Part; Datasheet: https://item.szlcsc.com/datasheet/TMI3112H/3428905.html; Supplier: LCSC; Function: Buck; Voltage - Supply: 2.7V~5.5V; Output Voltage: 600mV~5.5V; Output Current: 2A; Frequency - Switching: 2.3MHz; Operating Temperature: -40℃~+125℃@(TJ); Synchronous Rectifier: Yes; Number of Outputs: 1; Topology: Buck; Quiescent Current: 40uA; Switch tube (built-in/external): Built-in; Output Type: Adjustable
U7 U9 U11 U13 = FTC252012S1R0MBCA: Inductance:1uH Tolerance:±20% Tolerance:±20% Current Rating:4A Current - Saturation(Isat):5.6A DC Resistance(DCR):35mΩ Type:-; LCSC Part Name: 1uH ±20% 5.6A; Supplier Part: C5832370; Manufacturer: cjiang(长江微电); Supplier Footprint: 1008; JLCPCB Part Class: Extended Part; Datasheet: https://item.szlcsc.com/datasheet/FTC252012S1R0MBCA/6763490.html; Supplier: LCSC; Tolerance: ±20%; Current Rating: 4A; Current - Saturation(Isat): 5.6A; DC Resistance(DCR): 35mΩ
U14 = RT9013-18GB_C59969: Output Type:Fixed Voltage - Supply:5.5V Output Voltage:1.85V Output Voltage:1.85V Output Current:500mA Power Supply Rejection Ratio (PSRR):50dB@(10kHz) Voltage Dropout:400mV@(500mA) standby current:25uA Noise:30uVrms Features:Enable；Thermal Shutdown；Over; LCSC Part Name: 输入5.5V 输出1.8V~1.8V 500mA; Supplier Part: C59969; Manufacturer: RICHTEK(立锜); Supplier Footprint: SOT-23-5; JLCPCB Part Class: Extended Part; Datasheet: https://item.szlcsc.com/datasheet/RT9013-18GB/61021.html; Supplier: LCSC; Output Type: Fixed; Voltage - Supply: 5.5V; Output Voltage: 1.85V; Output Current: 500mA; Power Supply Rejection Ratio (PSRR): 50dB@(10kHz); Voltage Dropout: 400mV@(500mA); standby current: 25uA; Noise: 30uVrms; Features: Enable；Thermal Shutdown；Over Current Protection; Operating Temperature: -40℃~+85℃@(Ta); Output Configuration: Positive; Number of Outputs: 1
U25 = SGM2576YN5G/TR: Supplier Part: C699888; Manufacturer: SGMICRO(圣邦微); Supplier Footprint: SOT-23-5; JLCPCB Part Class: Extended Part; Datasheet: https://atta.szlcsc.com/upload/public/pdf/source/20220610/E6DDBDC08E20B458D59A786297FD8C94.pdf; Supplier: LCSC
U28 = EA3059QDR: LCSC Part Name: 四路电源管理集成电路; Supplier Part: C111586; Manufacturer: everanalog(申风); Supplier Footprint: QFN-24-EP(4x4); JLCPCB Part Class: Extended Part; Datasheet: https://item.szlcsc.com/datasheet/EA3059QDR/112813.html; Supplier: LCSC
U29-U32 = FTC252012S1R5MBCA: Inductance:1.5uH Tolerance:±20% Tolerance:±20% Current Rating:3.7A Current - Saturation(Isat):4.5A DC Resistance(DCR):44mΩ Type:-; LCSC Part Name: 1.5uH ±20% 4.5A; Supplier Part: C5832371; Manufacturer: cjiang(长江微电); Supplier Footprint: 1008; JLCPCB Part Class: Extended Part; Datasheet: https://item.szlcsc.com/datasheet/FTC252012S1R5MBCA/6763491.html; Supplier: LCSC; Tolerance: ±20%; Current Rating: 3.7A; Current - Saturation(Isat): 4.5A; DC Resistance(DCR): 44mΩ
U34 = MAX98357AETE+T: Class:Class D Speaker Channels:- Output Power:3.2W×1@4Ω Voltage - Supply:2.5V~5.5V Voltage - Supply:2.5V~5.5V Total Harmonic Distortion + Noise (THD+N):- Quiescent Current:2.4mA Operating Temperature:-40℃~+85℃ Operating Temperature:-40℃~+85℃ Power Supply; LCSC Part Name: 微型、低成本、PCM 类 D 级放大器具有 AB 级性能; Supplier Part: C910544; Manufacturer: ADI(亚德诺)/MAXIM(美信); Supplier Footprint: TQFN-16-EP(3x3); JLCPCB Part Class: Extended Part; Datasheet: https://item.szlcsc.com/datasheet/MAX98357AETE%252BT/978950.html; Supplier: LCSC; Class: Class D; Output Power: 3.2W×1@4Ω; Voltage - Supply: 2.5V~5.5V; Quiescent Current: 2.4mA; Operating Temperature: -40℃~+85℃; Power Supply Rejection Ratio (PSRR): 77dB; Efficiency: 92%
U35 = ZX-MX1.25-4PWZ: Pins Structure:1x4P Pitch:1.25mm Mounting Type:Right Angle Reference Series:PicoBlade(MX 1.25) Number of Pins:4P Number of Rows:1 Number of PINs Per Row:4 Row Spacing:- Current Rating:1A Contact Material:Brass Contact Plating:Tin Operating Temperature:-25; LCSC Part Name: 1x4P 间距:1.25mm 弯插 系列:PicoBlade(MX 1.25); Supplier Part: C7430465; Manufacturer: Megastar(兆星); Supplier Footprint: 弯插,P=1.25mm; JLCPCB Part Class: Extended Part; Datasheet: https://item.szlcsc.com/datasheet/ZX-MX1.25-4PWZ/8430334.html; Supplier: LCSC; Pins Structure: 1x4P; Pitch: 1.25mm; Mounting Type: Right Angle; Reference Series: PicoBlade(MX 1.25); Number of Pins: 4P; Number of Rows: 1; Number of PINs Per Row: 4; Current Rating: 1A; Contact Material: Brass; Contact Plating: Tin; Operating Temperature: -25℃~+85℃; Voltage Rating: 125V; Plastic Material: LCP; Flame Retardant Rating: UL94V-0; Color: Beige; Z-Height of the Board: 3.3mm; X-Length of Bottom Edge on Board (Spacing Line): 5.65mm; Y-Width of Bottom Edge on Board: 4.6mm
U36 = ZX-SH1.0-3PLT: Pins Structure:1x3P Pitch:1mm Mounting Type:Surface Mount,Vertical Reference Series:SH Number of Pins:3P Number of Rows:1 Number of PINs Per Row:3 Row Spacing:- Current Rating:1A Contact Material:Brass Contact Plating:Tin Operating Temperature:-40℃~+85℃ O; LCSC Part Name: 1x3P 间距:1mm 立贴 系列:SH; Supplier Part: C7430452; Manufacturer: Megastar(兆星); Supplier Footprint: SMD,P=1mm; JLCPCB Part Class: Extended Part; Datasheet: https://item.szlcsc.com/datasheet/ZX-SH1.0-3PLT/8430321.html; Supplier: LCSC; Pins Structure: 1x3P; Pitch: 1mm; Mounting Type: Surface Mount,Vertical; Reference Series: SH; Number of Pins: 3P; Number of Rows: 1; Number of PINs Per Row: 3; Current Rating: 1A; Contact Material: Brass; Contact Plating: Tin; Operating Temperature: -40℃~+85℃; Voltage Rating: 50V; Plastic Material: LCP; Supplementary Features: Auxiliary Solder Pin; Color: Beige; Z-Height of the Board: 4.4mm; X-Length of Bottom Edge on Board (Spacing Line): 5.35mm; Y-Width of Bottom Edge on Board: 3.05mm
U37 = XT26G04CWSIGA: Memory Size:4Gbit Interface:SPI Clock Frequency:104MHz Voltage - Supply:2.7V~3.6V Voltage - Supply:2.7V~3.6V Write Cycle Time(tWC):- Page Program time (TPP):360us Block Erase Time(tBE):4ms Data Retention - TDR (Year):10 Years Operating Temperature:- Opera; LCSC Part Name: SPI NAND; Supplier Part: C2833373; Manufacturer: XTX(芯天下); Supplier Footprint: WSON-8(6x8); JLCPCB Part Class: Extended Part; Datasheet: https://item.szlcsc.com/datasheet/XT26G04CWSIGA/2993661.html; Supplier: LCSC; Memory Size: 4Gbit; Interface: SPI; Clock Frequency: 104MHz; Voltage - Supply: 2.7V~3.6V; Page Program time (TPP): 360us; Block Erase Time(tBE): 4ms; Data Retention - TDR (Year): 10 Years; Standby Supply Current: 100uA; Program / Erase Cycles: 60,000 Cycles
U38 = DB125-2.54-3P-GN-S: Number of Positions or Pins:1x3P Pitch:2.54mm Color:- Mounting Type:Through Hole Number of Pins:3P Number of Rows:1 Number of PINs Per Row:3 Current Rating:7A Voltage Rating (Max):150V Wire Gauge - AWG:18~26 Wire Gauge - AWG:18~26 Wire Gauge - mm2:1 Wire; LCSC Part Name: 1x3P 2.54mm 直插 排数:1 每排P数:3; Supplier Part: C918121; Manufacturer: DORABO(地博电气); Supplier Footprint: 插件,P=2.54mm; JLCPCB Part Class: Extended Part; Datasheet: https://item.szlcsc.com/datasheet/DB125-2.54-3P-GN-S/993700.html; Supplier: LCSC; Number of Positions or Pins: 1x3P; Pitch: 2.54mm; Mounting Type: Through Hole; Number of Pins: 3P; Number of Rows: 1; Number of PINs Per Row: 3; Current Rating: 7A; Voltage Rating (Max): 150V; Wire Gauge - AWG: 18~26; Wire Gauge - mm2: 1; Operating Temperature: -40℃~+105℃
USB2 = TYPE-C 16PIN 2MD(073): Connector Type:Type-C Protocol Standard:USB 3.1 Gender:Female Mounting Type:Surface Mount, Right Angle Number of Contacts:16P Number of Ports:1 Current Rating-Power:3A Voltage Rating:5V Connect-Disconnect Life:5,000 Cycles Supplementary Features:- Center; LCSC Part Name: Type-C 母 卧贴; Supplier Part: C2765186; Manufacturer: SHOU HAN(首韩); Supplier Footprint: SMD; JLCPCB Part Class: Extended Part; Datasheet: https://atta.szlcsc.com/upload/public/pdf/source/20250506/FFB74EDFDFA0AC372CE4A8E4F739CCEF.pdf; Supplier: LCSC; Connector Type: Type-C; Protocol Standard: USB 3.1; Gender: Female; Mounting Type: Surface Mount, Right Angle; Number of Contacts: 16P; Number of Ports: 1; Current Rating-Power: 3A; Voltage Rating: 5V; Connect-Disconnect Life: 5,000 Cycles; Detection color: Black; Operating Temperature: -25℃~+85℃
USB4 = 10.0 QHHTZB6.3: Connector Type:Type-A Protocol Standard:USB 2.0 Gender:Female Mounting Type:Surface Mount, Right Angle Number of Contacts:4P Number of Ports:1 Current Rating-Power:1.5A Voltage Rating:30V Connect-Disconnect Life:5,000 times Supplementary Features:- Center; LCSC Part Name: 壳长10.0mm; Supplier Part: C668591; Manufacturer: SHOU HAN(首韩); Supplier Footprint: SMD; JLCPCB Part Class: Extended Part; Datasheet: https://item.szlcsc.com/datasheet/10.0%2520QHHTZB6.3/698534.html; Supplier: LCSC; Connector Type: Type-A; Protocol Standard: USB 2.0; Gender: Female; Mounting Type: Surface Mount, Right Angle; Number of Contacts: 4P; Number of Ports: 1; Current Rating-Power: 1.5A; Voltage Rating: 30V; Connect-Disconnect Life: 5,000 times; Length: 10mm; Detection color: Black; Operating Temperature: -25℃~+85℃
X3 = X322524MOB4SI: Type:Surface Mount Crystal Frequency:24MHz Normal temperature Frequency Tolerance:±10ppm Normal temperature Frequency Tolerance:±10ppm Load Capacitance:12pF Frequency Stability:±20ppm Frequency Stability:±20ppm Operating Temperature:-40℃~+85℃ Operating Te; LCSC Part Name: YSX321SL 24MHZ 4P 3225 12PF ±10PPM -40~85℃ (±20PPM); Supplier Part: C70590; Manufacturer: YXC(扬兴晶振); Supplier Footprint: SMD3225-4P; JLCPCB Part Class: Extended Part; Datasheet: https://item.szlcsc.com/datasheet/X322524MOB4SI/71688.html; Supplier: LCSC; Type: Surface Mount Crystal; Normal temperature Frequency Tolerance: ±10ppm; Load Capacitance: 12pF; Frequency Stability: ±20ppm; Operating Temperature: -40℃~+85℃

## Nets
GND: C1.1 C2.1 C3.1 C4.1 C5.1 C6.1 C7.1 C8.1 C9.1 C10.1 C11.1 C12.1 C13.1 C14.1 C15.1 C16.2 C17.1 C18.2 C19.1 C20.1 C21.1 C22.2 C23.2 C24.1 C25.1 C26.1 C27.1 C28.1 C29.1 C30.1 C31.1 C32.1 C34.1 C38.1 C40.1 C41.1 C43.1 C44.2 C45.1 C46.2 C47.1 C48.1 C52.1 C53.1 C61.1 C62.1 C63.1 C64.1 C70.1 C81.1 C82.1 C83.1 C84.1 C85.1 C86.2 C87.2 C88.1 C89.1 C90.1 C91.1 C92.1 C93.1 C94.1 C95.1 C96.1 D7.2(K) D8.2(GND) D10.2(GND) D11.2(K) MIC1.2(LR) MIC1.5(GND) R16.2 R17.1 R40.2 R41.2 R47.1 R50.1 R53.1 R63.1 R85.1 R86.1 R88.1 R90.1 R91.1 R92.1 R100.1 SW5.3 SW5.4 SW6.2 U1.24(VSS) U1.69(ACODEC_ADC_AVSS) U1.86(VSS) U1.111(VSS) U1.129(EP) U4.1 U5.1 U6.2(GND) U8.2(GND) U10.2(GND) U12.2(GND) U14.2(GND) U25.2(GND) U28.1(GND3) U28.4(AGND) U28.6(GND2) U28.13(GND1) U28.18(GND4) U28.25(EP) U34.3(GND) U34.11(GND) U34.15(GND) U34.17(EP) U35.2 U35.4 U36.3 U36.4 U36.5 U37.4(VSS) U37.9(EP) U38.2 USB2.1(GND) USB2.12(GND) USB2.13(SHELL) USB2.14(SHELL) USB4.4(GND) USB4.5 USB4.6 X3.2(GND) X3.4(GND)
VCC5V0_SYS: C32.2 C38.2 C41.2 C45.2 C61.2 C81.2 C82.2 C83.2 C84.2 C85.2 C92.2 C93.2 D8.5(VBUS) R45.2 R51.2 R58.2 R61.1 R95.2 R96.2 R97.2 R98.1 R99.1 TP3.1 TP9.1 U6.4(IN) U8.4(IN) U10.4(IN) U12.4(IN) U25.5(VIN) U28.3(VCC) U28.8(VIN2) U28.11(VIN1) U28.20(VIN4) U28.23(VIN3) U34.7(VDD) U34.8(VDD) U35.1 U38.1 USB2.2(VBUS) USB2.11(VBUS)
VCC_1V8: C17.2 C25.2 C26.2 C48.2 R35.2 R36.2 TP8.1 U1.64(AVCC_1V8) U1.76(AVDD_1V8) U1.120(SYS_PLL_AVDD1V8) U14.5(VOUT)
VCC_3V3: C19.2 C21.2 C24.2 C28.2 C29.2 C30.2 C31.2 C42.2 C43.2 C47.2 C52.2 C53.2 C71.1 C88.2 C94.2 C95.2 LED4.2(A) MIC1.1(Vdd) R33.2 R62.2 R77.2 R78.2 R87.2 R101.2 TP7.1 U1.9(PMUIO_VCC3V3) U1.39(VCCIO4_VCC) U1.52(VCCIO3_VCC) U1.56(VCCIO2_VCC) U1.70(USB20_OTG_AVDD3V3) U1.92(VCCIO1_VCC) U1.103(VCCIO1_VCC) U13.2 U14.1(VIN) U14.3(EN) U29.2 U34.4(SD_MODE#) U37.8(VCC)
VCC_DDR: C11.2 C12.2 C13.2 C14.2 C36.2 C70.2 C74.1 C91.2 R59.2 R89.2 TP5.1 U1.22(DDR_VDDQ) U1.23(DDR_VDDQ) U1.25(DDR_VDDQ) U9.2 U32.2
VCC_OTG: C62.2 C63.2 C64.2 D10.5(VBUS) TP2.1 U25.1(VOUT) USB4.1(VCC)
VDD_0V9: C5.2 C6.2 C7.2 C8.2 C9.2 C10.2 C20.2 C27.2 C33.2 C34.2 C72.2 C89.2 R46.2 R94.2 TP4.1 U1.11(PMU_LOGIC_DVDD0V9) U1.51(LOGIC_DVDD) U1.75(AVDD_0V9) U1.87(LOGIC_DVDD) U1.110(LOGIC_DVDD) U7.2 U30.2
VDD_CPU: C1.2 C2.2 C3.2 C4.2 C39.2 C40.2 C73.2 C90.2 R60.2 R93.2 TP6.1 U1.85(CPU_DVDD) U1.112(CPU_DVDD) U11.2 U31.2
ACTLED: LED5.2(A) U1.32(SAI2_SDO_M0/ETH_RMII1_CLK/GPIO3_B0_d)
DBG_CC1: R40.1 USB2.4(CC1)
DBG_CC2: R41.1 USB2.10(CC2)
DBG_DN: R81.2 U1.71(USB20_OTG0_DM)
DBG_DN_C: D8.1(IO1) USB2.5(DN2) USB2.7(DN1)
DBG_DP: R82.2 U1.72(USB20_OTG0_DP)
DBG_DP_C: D8.3(IO2) USB2.6(DP1) USB2.8(DP2)
FLASH_CLK: R34.2 U1.54(FSPI_CLK/GPIO2_A1_d)
FLASH_CS: U1.59(FSPI_CSN/GPIO2_A0_u) U37.1(CS#)
FLASH_D0: U1.55(FSPI_D0/GPIO2_A2_u) U37.5(SI(SIO0))
FLASH_D1: U1.58(FSPI_D1/GPIO2_A3_u) U37.2(SO(SIO1))
FLASH_D2: R77.1 U1.57(FSPI_D2/GPIO2_A4_u) U37.3(WP#(SIO2))
FLASH_D3: R78.1 U1.53(FSPI_D3/GPIO2_A5_u) U37.7(SIO3)
GPIO_R1: C96.2 D11.1(A) R101.1 SW5.1 SW5.2 U1.21(SAI0_LRCK/RM_IO0/GPIO0_A0_u) U35.3 U38.3
NPOR_L: C18.1 R33.1 U1.10(NPOR)
OSC_XI: C16.1 R7.2 U1.121(OSC_XIN) X3.3(OSC2)
OSC_XO: R6.1 R7.1 U1.122(OSC_XOUT)
OTG_DN: R83.2 U1.73(USB20_OTG1_DM)
OTG_DN_C: D10.1(IO1) USB4.2(D-)
OTG_DP: R84.2 U1.74(USB20_OTG1_DP)
OTG_DP_C: D10.3(IO2) USB4.3(D+)
PDM_CLK: MIC1.3(CLK) U1.20(SAI0_SCLK/RM_IO1/GPIO0_A1_d)
PDM_SDI: MIC1.4(DOUT) U1.19(SAI0_MCLK/RM_IO2/GPIO0_A2_u)
PMIC_EN1: C87.1 R98.2 U28.10(EN1)
PMIC_EN2: R95.1 U28.9(EN2)
PMIC_EN3: R96.1 U28.22(EN3)
PMIC_EN4: C86.1 R97.1 U28.21(EN4)
PMIC_FB1: C71.2 R87.1 R88.2 U28.14(FB1)
PMIC_FB2: C72.1 R92.2 R94.1 U28.5(FB2)
PMIC_FB3: C73.1 R91.2 R93.1 U28.2(FB3)
PMIC_FB4: C74.2 R89.1 R90.2 U28.17(FB4)
PMIC_LX1: U28.12(LX1) U29.1
PMIC_LX2: U28.7(LX2) U30.1
PMIC_LX3: U28.24(LX3) U31.1
PMIC_LX4: U28.19(LX4) U32.1
RM_IO3: U1.18(SAI0_SDO/RM_IO3/GPIO0_A3_d)
RM_IO4: U1.17(SAI0_SDI0/RM_IO4/GPIO0_A4_d)
RM_IO5: U1.16(SAI0_SDI1/RM_IO5/GPIO0_A5_d)
RM_IO6: U1.15(SAI0_SDI2/RM_IO6/GPIO0_A6_d)
RM_IO7: U1.14(SAI0_SDI3/SPI1_CSN1/RM_IO7/GPIO0_A7_d)
RM_IO8: U1.13(SAI1_MCLK/SPI1_CLK/RM_IO8/GPIO0_B0_d)
RM_IO9: U1.12(SAI1_SCLK/SPI1_MOSI/RM_IO9/GPIO0_B1_d)
RM_IO10: U1.8(SAI1_LRCK/SPI1_MISO/RM_IO10/GPIO0_B2_d)
RM_IO11: U1.7(SAI1_SDI/RM_IO11/GPIO0_B3_d)
RM_IO12: U1.6(SAI1_SDO0/RM_IO12/GPIO0_B4_d)
RM_IO13: U1.5(SAI1_SDO1/RM_IO13/GPIO0_B5_d)
RM_IO14: U1.4(SAI1_SDO2/SPI1_CSN0/RM_IO14/GPIO0_B6_d)
RM_IO15: U1.3(SAI1_SDO3/SPI0_CSN1/RM_IO15/GPIO0_B7_d) U34.14(LRCLK)
RM_IO16: U1.2(SPI0_CLK/RM_IO16/GPIO0_C0_d) U34.16(BCLK)
RM_IO17: U1.1(SPI0_MOSI/RM_IO17/GPIO0_C1_d) U34.1(DIN)
RM_IO18: U1.128(REF_CLK1_OUT/SPI0_MISO/RM_IO18/GPIO0_C2_d)
RM_IO19: U1.127(ETH_CLK1_25M_OUT/SPI0_CSN0/RM_IO19/GPIO0_C3_d)
RM_IO20: U1.126(ETH_CLK0_25M_OUT/AUPLL_CLK_IN/RM_IO20/GPIO0_C4_d)
RMII0_CLK: U1.48(ETH_RMII0_CLK/SPI2_MOSI/GPIO2_B2_d)
RMII0_MDC: U1.44(ETH_RMII0_MDC/DSM_AUD_LN_M1/SAI3_SDI/GPIO2_B6_d)
RMII0_MDIO: U1.43(ETH_RMII0_MDIO/DSM_AUD_LP_M1/SAI3_SDO/GPIO2_B7_d)
RMII0_NRST_GPIO: U1.33(SAI2_SCLK_M0/ETH_RMII1_RXD1/GPIO3_A7_d)
RMII0_RXD0: U1.50(ETH_RMII0_RXD0/SPI2_CLK/GPIO2_B0_d)
RMII0_RXD1: U1.49(ETH_RMII0_RXD1/SPI2_CSN/GPIO2_B1_d)
RMII0_RXDVCRS: U1.42(ETH_RMII0_RXDVCRS/SAI3_MCLK/GPIO2_C0_d)
RMII0_TXD0: U1.47(ETH_RMII0_TXD0/SPI2_MISO/GPIO2_B3_d)
RMII0_TXD1: U1.46(ETH_RMII0_TXD1/DSM_AUD_RN_M1/SAI3_SCLK/GPIO2_B4_d)
RMII0_TXEN: U1.45(ETH_RMII0_TXEN/DSM_AUD_RP_M1/SAI3_LRCK/GPIO2_B5_d)
SARADC_IN0_BOOT: C22.1 R35.1 R39.1 U1.62(SARADC_IN1/GPIO4_B1_z)
SARADC_IN1_RECOVER/KEY: C23.1 R36.1 U1.63(SARADC_IN0/GPIO4_B0_z)
SDMMC_CLK: U1.37(SDMMC_CLK/GPIO3_A0_d)
SDMMC_CMD: U1.38(SDMMC_CMD/GPIO3_A1_d)
SDMMC_D0: U1.36(SDMMC_D0/GPIO3_A2_d)
SDMMC_D1: U1.35(SDMMC_D1/TEST_CLK_OUT/GPIO3_A3_d)
SDMMC_D2: U1.41(SDMMC_D2/JTAG_TCK_M0/GPIO3_A4_d)
SDMMC_D3: U1.40(SDMMC_D3/JTAG_TMS_M0/GPIO3_A5_d)
SDMMC_DET: U1.34(SAI2_SDI_M0/ETH_RMII1_RXD0/GPIO3_A6_d)
SPKN: CN1.2 U34.10(OUTN)
SPKP: CN1.1 U34.9(OUTP)
UART0_RX: R42.1 U1.123(UART0_RX/JTAG_TMS_M1/RM_IO23/GPIO0_C7_u)
UART0_TX: R43.1 U1.124(UART0_TX/JTAG_TCK_M1/RM_IO22/GPIO0_C6_u)
USB20_OTG1_DRV_H: R85.2 U1.83(VO_LCDC_DEN/DSMC_CLKP/FLEXBUS1_D0/GPIO1_A0_d) U25.4(EN)
$1N2186: C15.2 R6.2 X3.1(OSC1)
$1N6299: R42.2 U5.2 U36.2
$1N6301: R43.2 U4.2 U36.1
$1N6766: D7.1(A) R39.2 SW6.1
$1N16618: R34.1 U37.6(SCLK)
$1N16657: D8.6(IO1) R81.1
$1N16696: D8.4(IO2) R82.1
$1N16990: D10.6(IO1) R83.1
$1N16994: D10.4(IO2) R84.1
$1N17405: R86.2 U25.3(ILIM)
$1N24281: LED4.1(K) R16.1
$1N24284: LED5.1(K) R17.2
$1N101009: R99.2 R100.2 U34.2(GAIN_SLOT)
Net-(C33-1): C33.1 R46.1 R47.2 U6.5(FB)
Net-(C36-1): C36.1 R50.2 R59.1 U8.5(FB)
Net-(C39-1): C39.1 R53.2 R60.1 U10.5(FB)
Net-(C42-1): C42.1 R62.1 R63.2 U12.5(FB)
Net-(C44-1): C44.1 R58.1 U8.1(EN)
Net-(C46-1): C46.1 R61.2 U12.1(EN)
Net-(R45-1): R45.1 U6.1(EN)
Net-(R51-1): R51.1 U10.1(EN)
Net-(U6-3): U6.3(LX) U7.1
Net-(U8-3): U8.3(LX) U9.1
Net-(U10-3): U10.3(LX) U11.1
Net-(U12-3): U12.3(LX) U13.1

Not connected (* = marked no-connect by the designer): U1 26(SAI2_MCLK_M0/ETH_RMII1_RXDVCRS/GPIO3_B6_d) 27(UART5_RTSN_M0/ETH_RMII1_MDIO/GPIO3_B5_d) 28(UART5_TX_M0/ETH_RMII1_MDC/GPIO3_B4_d) 29(UART5_RX_M0/ETH_RMII1_TXEN/GPIO3_B3_d) 30(UART5_CTSN_M0/ETH_RMII1_TXD1/GPIO3_B2_d) 31(SAI2_LRCK_M0/ETH_RMII1_TXD0/GPIO3_B1_d) 60(SARADC_IN3/GPIO4_B3_z) 61(SARADC_IN2/GPIO4_B2_z) 65(ACODEC_ADC_AVDD1V6) 66(ACODEC_ADC_VCM) 67(ACODEC_ADC_INN) 68(ACODEC_ADC_INP) 77(MIPI_DPHY_DSI_TX_CLKN/GPO4_A4_z) 78(MIPI_DPHY_DSI_TX_CLKP/GPO4_A5_z) 79(MIPI_DPHY_DSI_TX_D1N/GPO4_A2_z) 80(MIPI_DPHY_DSI_TX_D1P/GPO4_A3_z) 81(MIPI_DPHY_DSI_TX_D0N/GPO4_A0_z) 82(MIPI_DPHY_DSI_TX_D0P/GPO4_A1_z) 84(VO_LCDC_VSYNC/DSMC_CLKN/FLEXBUS1_D1/DSMC_INT0/DSMC_SLV_INT/GPIO1_A1_d) 88(VO_LCDC_HSYNC/DSMC_DQS0/FLEXBUS1_D2/GPIO1_A2_d) 89(VO_LCDC_CLK/DSMC_D0/FLEXBUS1_D3/GPIO1_A3_d) 90(VO_LCDC_D23/DSMC_D1/FLEXBUS1_D4/GPIO1_A4_d) 91(VO_LCDC_D22/DSMC_D2/FLEXBUS1_D5/GPIO1_A5_d) 93(VO_LCDC_D21/DSMC_D3/FLEXBUS1_D6/GPIO1_A6_d) 94(VO_LCDC_D20/DSMC_D4/FLEXBUS1_D7/GPIO1_A7_d) 95(VO_LCDC_D19/DSMC_D5/FLEXBUS1_D8/FLEXBUS0_CSN_M0/GPIO1_B0_d) 96(VO_LCDC_D18/DSMC_CSN1/FLEXBUS1_D9/FLEXBUS1_CSN_M0/UART5_CTSN_M1/RM_IO24/GPIO1_B1_d) 97(VO_LCDC_D17/DSMC_INT2/FLEXBUS1_D10/FLEXBUS0_D15/FLEXBUS0_CSN_M1/SAI2_SCLK_M1/RM_IO25/GPIO1_B2_d) 98(VO_LCDC_D16/DSMC_INT3/FLEXBUS1_D11/FLEXBUS0_D14/FLEXBUS1_CSN_M1/SAI2_LRCK_M1/RM_IO26/GPIO1_B3_d) 99(VO_LCDC_D15/DSMC_D6/FLEXBUS1_D12/FLEXBUS0_D13/FLEXBUS0_CSN_M2/GPIO1_B4_d) 100(VO_LCDC_D14/DSMC_D7/FLEXBUS1_D13/FLEXBUS0_D12/FLEXBUS1_CSN_M2/GPIO1_B5_d) 101(VO_LCDC_D13/DSMC_CSN0/FLEXBUS1_D14/FLEXBUS0_D11/FLEXBUS0_CSN_M3/GPIO1_B6_d) 102(VO_LCDC_D12/DSMC_RDYN/FLEXBUS1_D15/FLEXBUS0_D10/FLEXBUS1_CSN_M3/GPIO1_B7_d) 104(VO_LCDC_D11/DSMC_RESETN/FLEXBUS1_CLK/DSMC_INT1/FLEXBUS0_CSN_M4/DSMC_SLV_CLK/GPIO1_C0_d) 105(VO_LCDC_D10/DSMC_D8/FLEXBUS0_CLK/DSM_AUD_RN_M0/FLEXBUS1_CSN_M4/SAI2_MCLK_M1/DSMC_SLV_DQS0/GPIO1_C1_d) 106(VO_LCDC_D9/DSMC_D9/FLEXBUS0_D9/DSM_AUD_RP_M0/FLEXBUS0_CSN_M5/SAI2_SDI_M1/RM_IO27/DSMC_SLV_D0/GPIO1_C2_d) 107(VO_LCDC_D8/DSMC_D10/FLEXBUS0_D8/FLEXBUS1_CSN_M5/SAI2_SDO_M1/RM_IO28/DSMC_SLV_D1/GPIO1_C3_d) 108(VO_LCDC_D7/DSMC_D11/FLEXBUS0_D7/DSMC_SLV_D2/GPIO1_C4_d) 109(VO_LCDC_D6/DSMC_D12/FLEXBUS0_D6/DSMC_SLV_D3/GPIO1_C5_d) 113(VO_LCDC_D5/DSMC_D13/FLEXBUS0_D5/DSMC_SLV_D4/GPIO1_C6_d) 114(VO_LCDC_D4/DSMC_D14/FLEXBUS0_D4/DSMC_SLV_D5/GPIO1_C7_d) 115(VO_LCDC_D3/DSMC_D15/FLEXBUS0_D3/DSM_AUD_LN_M0/DSMC_SLV_D6/GPIO1_D0_d) 116(VO_LCDC_D2/DSMC_DQS1/FLEXBUS0_D2/DSM_AUD_LP_M0/UART5_RTSN_M1/RM_IO29/DSMC_SLV_D7/GPIO1_D1_d) 117(VO_LCDC_D1/DSMC_CSN2/FLEXBUS0_D1/UART5_TX_M1/RM_IO30/DSMC_SLV_CSN0/GPIO1_D2_d) 118(VO_LCDC_D0/DSMC_CSN3/FLEXBUS0_D0/UART5_RX_M1/RM_IO31/DSMC_SLV_RDYN/GPIO1_D3_d) 119(OSC_CLK_OUT/REF_CLK0_OUT/GPIO0_D0_d) 125(CPU_AVS/RM_IO21/GPIO0_C5_z); U14 4(NC); U28 15(NC) 16(NC); U34 5(N.C.) 6(N.C.) 12(N.C.) 13(N.C.); USB2 3(SBU2)* 9(SBU1)*

## Notes on the sheet
- PMIC (new, replaces discrete bucks below)
- I2S Amp/SPK
- R99: 0R=6dB, 100K=3dB
  R100: 0R=12dB, 100K=15dB
  Default: DNP=9dB
- PDM Mic
- Ring Button
  + Header
- Debug UART
- USB (x2)
- NAND Flash
- USB0: USB-C connector (Device)
- USB1: USB-A connector, Host
- LED
- Power rails (LDO & caps only)
- Decoupling caps
  Place close to SoC pins
- #1
